# EAGLE design V-USB Volume Control T2313 V1.1 60mm x 60mm (EAGLE 6.5.0)
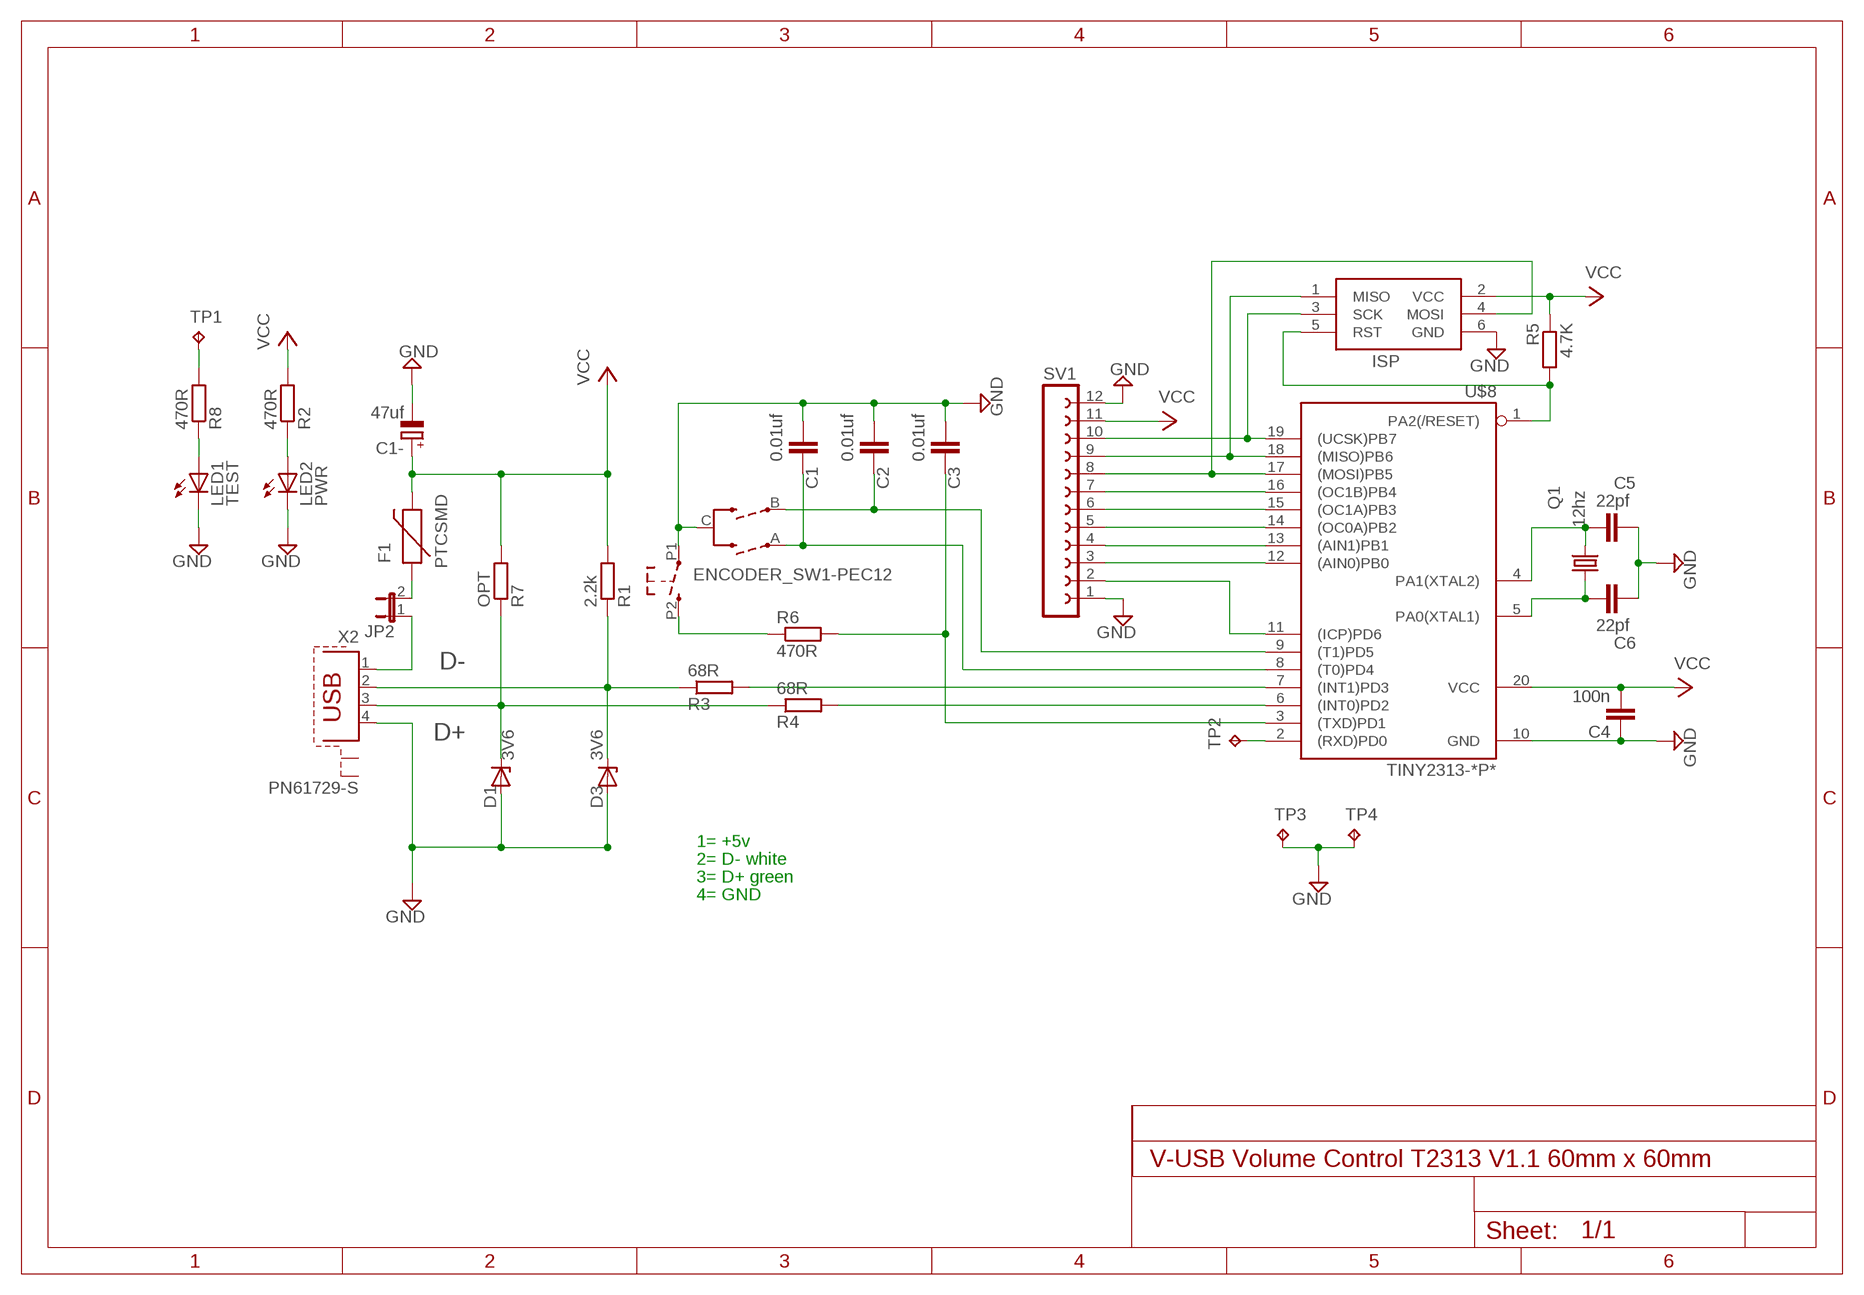
[diagram p0: schematic, sheet 1]

## Parts
C1  0.01uf  C5/2.5  [C5B2.5]
C1-  47uf  CPOL-EUE2.5-6  [E2,5-6]
C2  0.01uf  C5/2.5  [C5B2.5]
C3  0.01uf  C5/2.5  [C5B2.5]
C4  100n  C5/2.5  [C5B2.5]
C5  22pf  C2.5/2  [C2.5-2]
C6  22pf  C2.5/2  [C2.5-2]
D1  3V6  ZENER-DIODEDO34-7  [DO34Z7]
D3  3V6  ZENER-DIODEDO34-7  [DO34Z7]
F1  PTCSMD  [PTC-1206]
ISP  AVRISP-6  [AVRISP]
JP2  JP1E  [JP1]
LED1  TEST  LED3MM  [LED3MM]
LED2  PWR  LED3MM  [LED3MM]
Q1  12hz  CRYSTALHC49S  [HC49/S]
R1  2.2k  R-EU_0207/10  [0207/10]
R2  470R  R-EU_0204/7  [0204/7]
R3  68R  R-EU_0207/10  [0207/10]
R4  68R  R-EU_0207/10  [0207/10]
R5  4.7K  R-EU_0204/7  [0204/7]
R6  470R  R-EU_0204/7  [0204/7]
R7  OPT  R-EU_0207/10  [0207/10]
R8  470R  R-EU_0207/10  [0207/10]
SV1  FE12-1  [FE12]
SW3  ENCODER_SW1-PEC12  [PEC12_INCREMENTAL_ENCODER]
TP1  TPPAD1-13  [P1-13]
TP2  TPPAD1-13  [P1-13]
TP3  TPPAD1-20Y  [P1-20Y]
TP4  TPPAD1-20Y  [P1-20Y]
U$8  TINY2313-*P*  [DIL20]
X2  PN61729-S  [PN61729-S]

## Nets
D+: D1.C R4.1 R7.1 X2.3
D-: D3.C R1.1 R3.1 X2.2
ENC-A-P3: C1.2 SW3.A(ENCODER:A) U$8.8((T0)PD4)
ENC-B-P2: C2.2 SW3.B(ENCODER:B) U$8.9((T1)PD5)
GND: C1-.- C1.1 C2.1 C3.1 C4.1 C5.2 C6.2 D1.A D3.A ISP.6(GND) LED1.K(C) LED2.K(C) SV1.1 SV1.12 SW3.C(ENCODER:C) SW3.P1 TP3.TP TP4.TP U$8.10(GND) X2.4
MUTE: C3.2 R6.2 U$8.3((TXD)PD1)
N$1: ISP.4(MOSI) SV1.8 U$8.17((MOSI)PB5)
N$2: LED2.A R2.1
N$3: SV1.3 U$8.12((AIN0)PB0)
N$4: SV1.4 U$8.13((AIN1)PB1)
N$6: ISP.3(SCK) SV1.10 U$8.19((UCSK)PB7)
N$7: SV1.5 U$8.14((OC0A)PB2)
N$8: C6.1 Q1.1 U$8.5(PA0(XTAL1))
N$9: SV1.6 U$8.15((OC1A)PB3)
N$10: SV1.7 U$8.16((OC1B)PB4)
N$11: R6.1 SW3.P2
N$12: JP2.1 X2.1
N$13: C5.1 Q1.2 U$8.4(PA1(XTAL2))
N$14: ISP.5(RST) R5.2 U$8.1(PA2(/RESET))
N$15: R4.2 U$8.6((INT0)PD2)
N$16: ISP.1(MISO) SV1.9 U$8.18((MISO)PB6)
N$17: SV1.2 U$8.11((ICP)PD6)
N$18: R3.2 U$8.7((INT1)PD3)
N$19: TP2.TP U$8.2((RXD)PD0)
N$20: F1.1 JP2.2
N$21: LED1.A R8.1
N$22: R8.2 TP1.TP
VCC: C1-.+ C4.2 F1.2 ISP.2(VCC) R1.2 R2.2 R5.1 R7.2 SV1.11 U$8.20(VCC)
Unconnected: X2.S1 X2.S2

## Notes on the sheet
- 1= +5v
- 2= D- white
- 3= D+ green
- 4= GND

## Library data of the parts
C1-C6 = capacitor-wima:C: CAPACITOR naming: grid - package width
C1- = rcl:CPOL-EU: POLARIZED CAPACITOR, European symbol
D1 D3 = diode:ZENER-DIODE: Z-Diode
F1 = SparkFun:PTC: Resettable Fuse PTC Resettable Fuse. Spark Fun Electronics SKU : COM-08357
ISP = adafruit:AVRISP: AVR ISP HEADER Standard 6 pin header for AVR programming
JP2 = jumper:JP1E: JUMPER
LED1 LED2 = led:LED: LED OSRAM: - CHIPLED LG R971, LG N971, LY N971, LG Q971, LY Q971, LO R971, LY R971 LH N974, LH R974 LS Q976, LO Q976, LY Q976 LO Q996 - Hyper CHIPLED LW Q18S LB Q993, LB Q99A, LB R99A - SideLED LS A670, LO A670, LY A670, LG A670, LP A670 LB A673, LV A673, LT A673, LW A673 LH A674 LY A675 LS A676, LA A676, LO A676, LY A676, LW A676 LS A679, LY A679, LG A679 - Hyper Micro SIDELED® LS Y876, LA Y876, LO Y876, LY Y876 LT Y87S - SmartLED LW L88C, LW L88S LB L89C, LB L89S, LG L890 LS L89K, LO L89K, LY L89K LS L896, LA L896, LO L896, LY L896 - TOPLED LS T670, LO T670, LY T670, LG T670, LP T670 LSG T670, LSP T670, LSY T670, LOP T670, LYG T670 LG T671, LOG T671, LSG T671 LB T673, LV T673, LT T673, LW T673 LH T674 LS T676, LA T676, LO T676, LY T676, LB T676, LH T676, LSB T676, LW T676 LB T67C, LV T67C, LT T67C, LS T67K, LO T67K, LY T67K, LW E67C LS E67B, LA E67B, LO E67B, LY E67B, LB E67C, LV E67C, LT E67C LW T67C LS T679, LY T679, LG T679 LS T770, LO T770, LY T770, LG T770, LP T770 LB T773, LV T773, LT T773, LW T773 LH T774 LS E675, LA E675, LY E675, LS T675 LS T776, LA T776, LO T776, LY T776, LB T776 LHGB T686 LT T68C, LB T68C - Hyper Mini TOPLED® LB M676 - Mini TOPLED Santana® LG M470 LS M47K, LO M47K, LY M47K Source: http://www.osram.convergy.de LUXEON: - LUMILED® LXK2-PW12-R00, LXK2-PW12-S00, LXK2-PW14-U00, LXK2-PW14-V00 LXK2-PM12-R00, LXK2-PM12-S00, LXK2-PM14-U00 LXK2-PE12-Q00, LXK2-PE12-R00, LXK2-PE12-S00, LXK2-PE14-T00, LXK2-PE14-U00 LXK2-PB12-K00, LXK2-PB12-L00, LXK2-PB12-M00, LXK2-PB14-N00, LXK2-PB14-P00, LXK2-PB14-Q00 LXK2-PR12-L00, LXK2-PR12-M00, LXK2-PR14-Q00, LXK2-PR14-R00 LXK2-PD12-Q00, LXK2-PD12-R00, LXK2-PD12-S00 LXK2-PH12-R00, LXK2-PH12-S00 LXK2-PL12-P00, LXK2-PL12-Q00, LXK2-PL12-R00 Source: www.luxeon.com KINGBRIGHT: KA-3528ASYC Source: www.kingbright.com
Q1 = adafruit:CRYSTAL: CRYSTAL; OC_FARNELL: 1667008; OC_NEWARK: unknown
R1-R8 = resistor:R-EU_: RESISTOR, European symbol
SV1 = con-lsta:FE12-1: FEMALE HEADER; OC_FARNELL: unknown; OC_NEWARK: unknown
SW3 = dp_devices:ENCODER_SW1: Incremental Encoder with push switch
TP1-TP4 = testpad:TP: Test pad
U$8 = avr-7:TINY2313*: Atmel Tiny2313 2K Flash, 128 bytes EEPROM, 128 bytes RAM
X2 = con-berg:PN61729-S: BERG USB connector; OC_FARNELL: unknown; OC_NEWARK: unknown

## Board
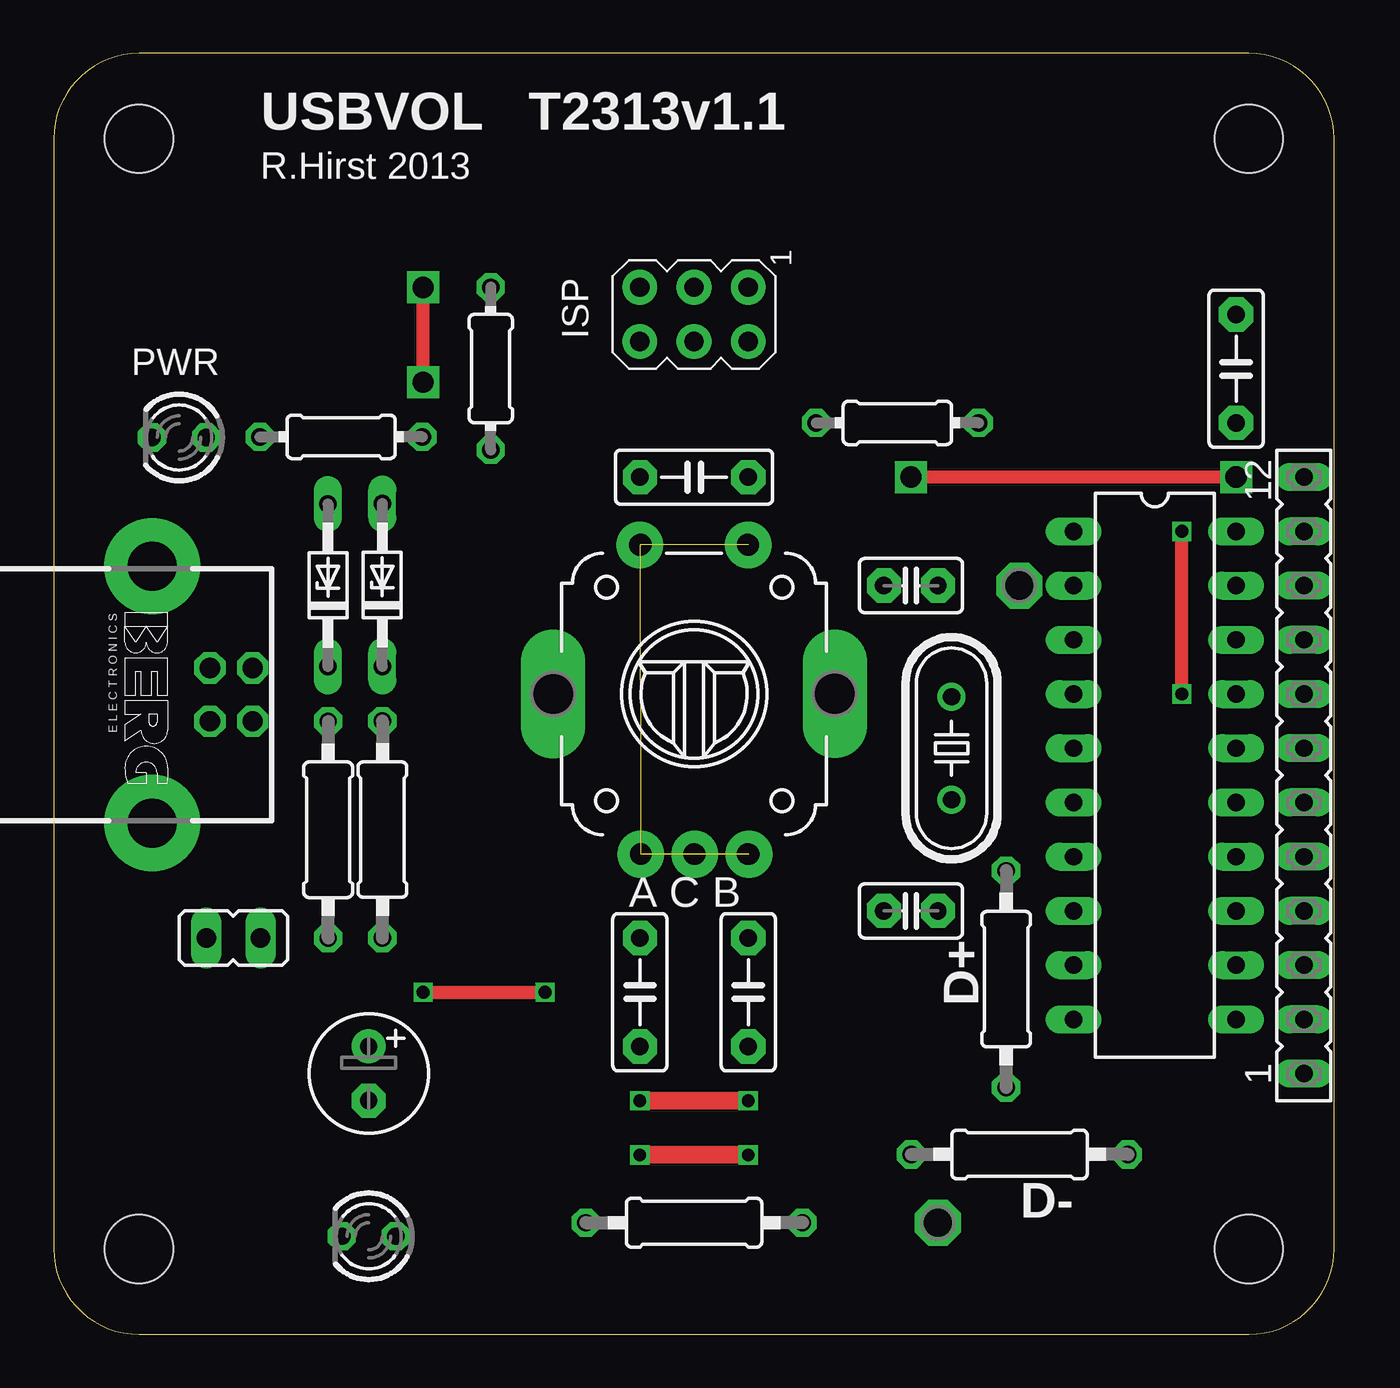
[diagram p1: board, top side]
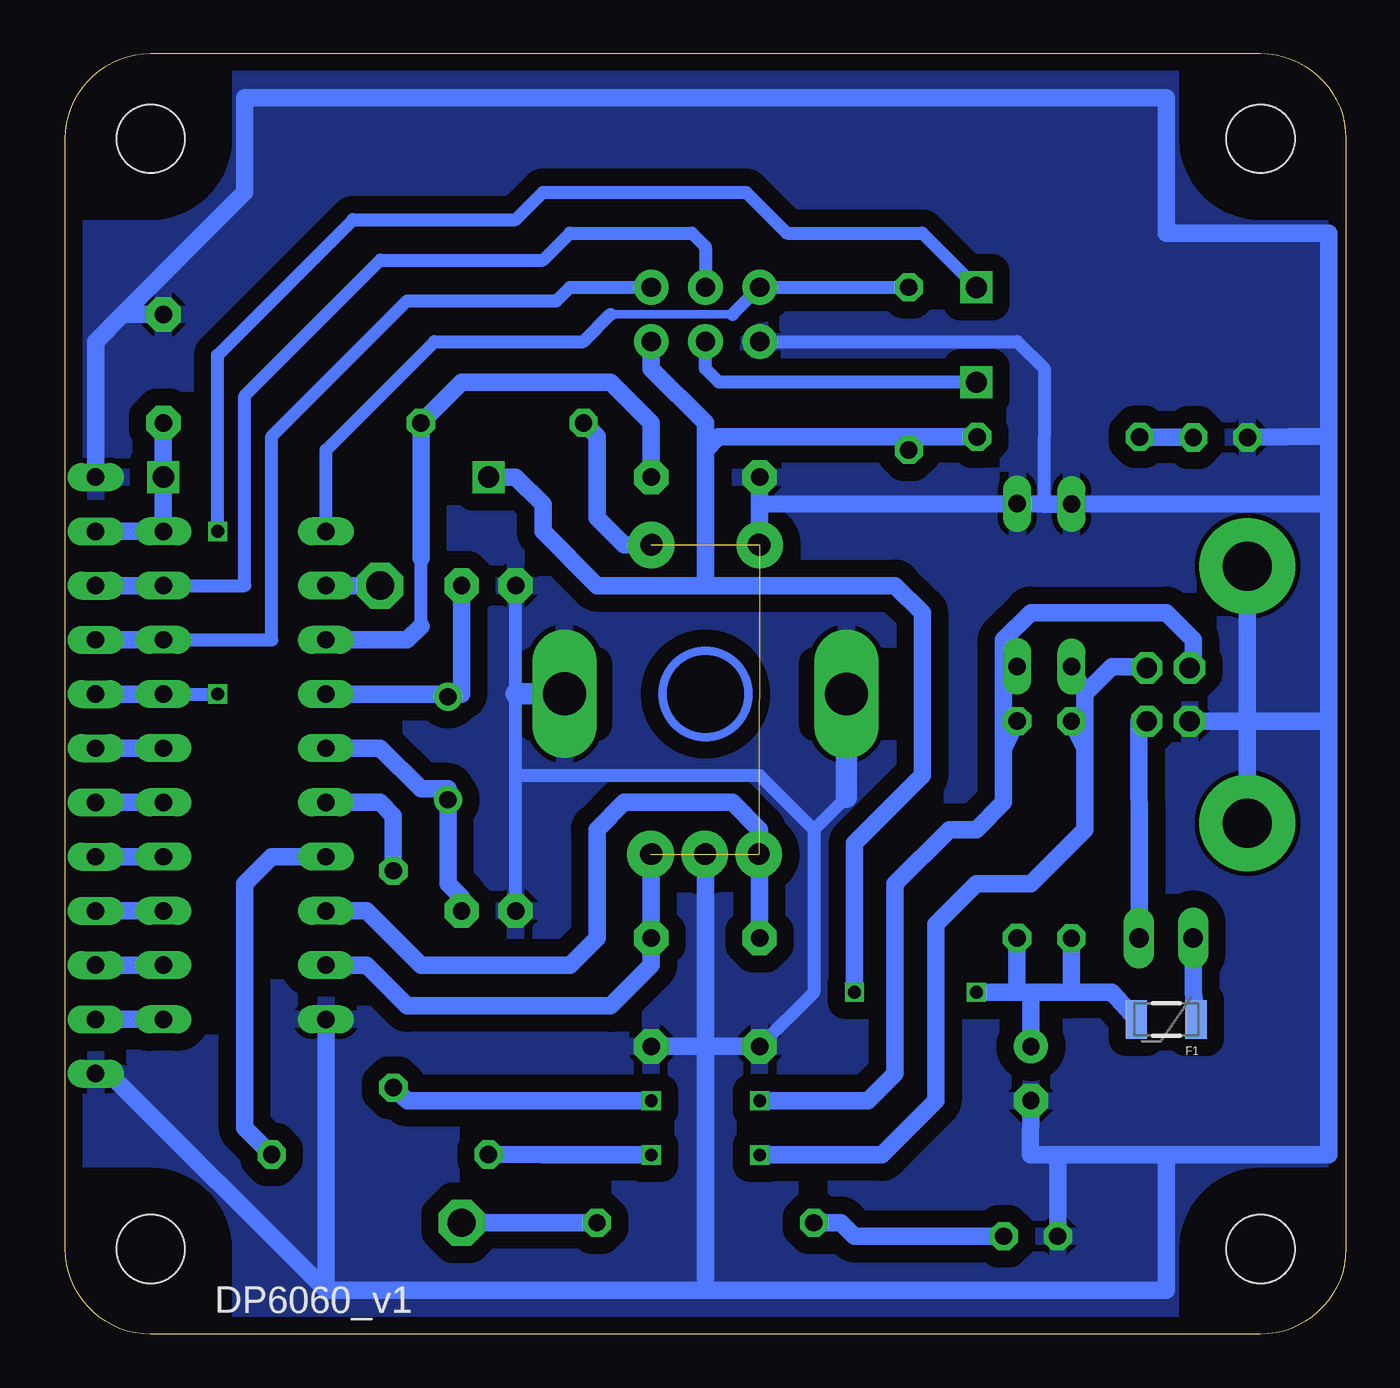
[diagram p2: board, bottom side, seen from below]

Size 60 x 60 mm. Coordinates in mm from the lower left corner, seen from the top.
Copper layers (1*16): Top 0.035mm / dielectric 1.5mm / Bottom 0.035mm
Design rules "Fusion_eagle_rule_v1.1 *": minimum track width 6mil, minimum drill 12mil, track to track 20mil, track to pad 20mil, pad to pad 20mil, via to via 20mil, smd to smd 8mil, copper to edge 4mil, drill to drill 4mil, minimum pad ring 10mil, minimum via ring 6mil, stop-mask expansion 2mil, vias tented up to drill 100mil, thermal gap 10mil

### Footprints (pad centres in the part's own frame; a part is rotated, then mirrored left to right if it is on the bottom)
C5B2.5 = drill 0.813 pad 1.6 octagon: 1 -2.54,0; 2 2.54,0
E2,5-6 = drill 0.813 pad 1.6: + -1.27,0 | drill 0.813 pad 1.6 octagon: - 1.27,0
C2.5-2 = drill 0.813 pad 1.6 octagon: 1 -1.27,0; 2 1.27,0
DO34Z7 = drill 0.813 long: A 3.81,0; C -3.81,0
PTC-1206 = smd 1 x 1.8: 1 -1.4,0; 2 1.4,0
AVRISP = drill 0.9 pad 1.626: 1 -1.27,2.54; 2 1.27,2.54; 3 -1.27,0; 4 1.27,0; 5 -1.27,-2.54; 6 1.27,-2.54
JP1 = drill 0.914 long: 1 0,-1.27; 2 0,1.27
LED3MM = drill 0.813 octagon: A -1.27,0; K 1.27,0
HC49/S = drill 0.813: 1 -2.413,0; 2 2.413,0
0207/10 = drill 0.813 octagon: 1 -5.08,0; 2 5.08,0
0204/7 = drill 0.813 octagon: 1 -3.81,0; 2 3.81,0
FE12 = drill 0.813 long: 1 -13.97,0; 2 -11.43,0; 3 -8.89,0; 4 -6.35,0; 5 -3.81,0; 6 -1.27,0; 7 1.27,0; 8 3.81,0; 9 6.35,0; 10 8.89,0; 11 11.43,0; 12 13.97,0
PEC12_INCREMENTAL_ENCODER = drill 1: A -2.5,-7.5; B 2.5,-7.5; C 0,-7.5; P1 -2.5,7; P2 2.5,7 | drill 1.9 square: GND@1 -6.6,0; GND@2 6.6,0
P1-13 = drill 1.321 pad 2.159 octagon: TP 0,0
P1-20Y = drill 2.007 pad 2.54 long: TP 0,0
DP6060_V1 = hole 3.2: 4,4; 56,4; 56,56; 4,56; 4,4; 56,4; 56,56; 4,56
DIL20 = drill 0.813 long: 1 -11.43,-3.81; 2 -8.89,-3.81; 3 -6.35,-3.81; 4 -3.81,-3.81; 5 -1.27,-3.81; 6 1.27,-3.81; 7 3.81,-3.81; 8 6.35,-3.81; 9 8.89,-3.81; 10 11.43,-3.81; 11 11.43,3.81; 12 8.89,3.81; 13 6.35,3.81; 14 3.81,3.81; 15 1.27,3.81; 16 -1.27,3.81; 17 -3.81,3.81; 18 -6.35,3.81; 19 -8.89,3.81; 20 -11.43,3.81
PN61729-S = drill 0.95 octagon: 1 1.25,4.71; 2 -1.25,4.71; 3 -1.25,2.71; 4 1.25,2.71 | drill 2.3 pad 2.9: S1 -6.02,0; S2 6.02,0

### Placement (x,y rotation side)
C1  27.47,16.02 90 top
C1-  14.76,12.22 270 top
C2  32.55,16.02 90 top
C3  30.01,40.15 0 top
C4  55.41,45.23 270 top
C5  40.17,35.07 180 top
C6  40.17,19.83 180 top
D1  15.4,35.1 90 top
D3  12.85,35.08 90 top
F1  8.41,14.75 180 bottom
ISP  30.01,47.77 270 top
JP2  8.42,18.56 90 top
LED1  14.77,4.59 180 top
LED2  5.88,42.01 180 top
Q1  42.07,27.45 90 top
R1  12.86,23.63 270 top
R2  13.47,42.04 0 top
R3  45.25,8.42 0 top
R4  44.63,16.63 90 top
R5  20.48,45.24 90 top
R6  39.53,42.69 0 top
R7  15.4,23.64 270 top
R8  30.01,5.23 0 top
SV1  58.58,26.18 90 top
SW3  30.01,29.99 0 top
TP1  41.44,5.23 0 top
TP2  45.25,35.07 0 top
TP3  36.6,30.01 0 top
TP4  23.4,29.99 0 top
U$2  [DP6060_V1]  0,0 0 top
U$8  51.6,26.18 270 top
X2  4.61,29.96 270 top

### Tracks (layer width: path | path; a pad name or v marks a point on that pad's centre or on a via)
D+  (via drill 0.6)
  Top 0.813: v27.47,10.94 v32.55,10.94
  Bottom 0.813: 16.03,27.45 R7.1 16.03,27.45 | 16.03,27.45 16.03,31.26 | 16.03,31.26 16.03,32.53 14.77,33.8 8.42,33.8 7.15,32.53 7.15,31.38 X2.3 | D1.C 16.01,31.29 16.03,31.26 | 16.03,27.45 16.04,27.45 16.04,24.91 17.31,23.64 18.58,23.64 21.12,21.1 21.12,12.21 22.39,10.94 v27.47,10.94 | v32.55,10.94 43.97,10.94 R4.1
D-  (via drill 0.6)
  Top 0.813: v27.47,8.4 v32.55,8.4
  Bottom 0.813: 12.23,27.45 12.23,23.64 14.77,21.1 17.31,21.1 19.21,19.2 19.21,10.94 21.74,8.41 26.19,8.41 v27.47,8.4 | 12.23,27.45 12.23,29.99 12.22,30 | 12.22,30 10.96,31.26 9.37,31.26 X2.2 | D3.C 12.22,30 | R1.1 12.23,27.44 12.23,27.45 | v32.55,8.4 37.61,8.4 R3.1
ENC-A-P3
  Bottom 0.813: C1.2 27.47,22.45 SW3.A 27.47,22.53 27.47,23.64 28.74,24.91 33.82,24.91 35.09,23.64 35.09,18.56 36.36,17.29 43.34,17.29 45.88,19.83 U$8.8
ENC-B-P2
  Bottom 0.813: SW3.B 32.55,22.45 C2.2 32.55,17.29 34.45,15.39 43.98,15.39 45.88,17.29 U$8.9
GND  (via drill 1.1 pad 4.5)
  Bottom 0.406: v4.61,35.98 4.61,28.72
  Bottom 0.61: 38.9,29.99 C6.2 38.9,26.18 27.47,26.18 24.93,23.64 | 38.9,29.99 C5.2 | 24.93,23.64 24.93,16.02 C1.1 | 23.4,25.16 24.93,23.64 | 38.88,30.01 38.9,29.99 | ISP.6 15.4,46.5 14.13,45.23 14.14,38.89
  Bottom 0.813: 0.8,42.06 0.8,38.88 | 0.8,38.88 0.8,28.72 | v4.61,35.98 v4.61,23.96 v4.61,23.95 | 0.8,28.72 4.61,28.72 7.15,28.71 X2.4 | 30.01,22.37 SW3.C 30.01,13.48 | 30.01,13.48 30.01,2.05 | 27.47,38.88 D1.A 14.14,38.89 13.5,38.88 D3.A 0.8,38.88 | 27.47,38.88 C3.1 | 27.47,38.88 SW3.P1 | LED2.K 0.8,42.06 | 0.8,28.72 0.8,8.4 8.42,8.4 | 30.01,2.05 8.42,2.05 8.42,8.4 | 8.42,8.4 8.44,8.4 | 30.01,2.05 47.79,2.05 | 47.79,2.05 U$8.10 | C1-.- 14.77,8.41 13.5,8.4 | 13.5,8.4 8.42,8.4 | 0.8,42.06 0.8,51.58 8.42,51.58 8.42,57.93 51.6,57.93 51.6,53.49 57.31,47.77 | C1.1 30.01,13.48 | C2.1 30.01,13.48 | SV1.1 57.95,12.21 47.79,2.05 | 57.31,47.77 58.58,46.5 SV1.12 | C4.1 57.31,47.77 | LED1.K 13.5,8.4
  Bottom 1.016: TP4.TP 23.4,25.16 | TP3.TP 38.88,30.01
  pour Bottom (isolate 0.813): 60.49,-0.49 -0.55,-0.51 -0.47,60.47 60.49,60.47
MUTE
  Bottom 0.61: 43.34,33.17 43.34,36.34
  Bottom 0.813: C3.2 32.55,42.69 34.45,44.6 41.44,44.6 R6.2 43.34,36.34 | U$8.3 43.98,32.53 43.34,33.17
N$1  (via drill 0.6, 1)
  Top 0.61: v17.31,44.6 v17.31,49.04 | v52.87,29.99 v52.87,37.61
  Bottom 0.61: U$8.17 v52.87,29.99 | v17.31,44.6 29.37,44.6 30.01,45.23 ISP.4 | v17.31,49.04 19.85,51.58 26.2,51.58 28.1,53.49 37.63,53.49 38.9,52.22 46.52,52.22 52.87,45.87 v52.87,37.61
  Bottom 0.813: U$8.17 SV1.8
N$2
  Bottom 0.61: 9.63,42.01 R2.1
  Bottom 0.813: LED2.A 9.63,42.01
N$3
  Bottom 0.813: U$8.12 SV1.3
N$4
  Bottom 0.813: U$8.13 SV1.4
N$6
  Bottom 0.61: U$8.19 51.6,35.07 51.6,43.96 45.25,50.31 37.63,50.31 36.36,51.58 30.64,51.58 30.01,50.95 ISP.3
  Bottom 0.813: SV1.10 U$8.19
N$7
  Bottom 0.813: U$8.14 SV1.5
N$8
  Bottom 0.813: C6.1 41.44,20.47 42.07,21.1 Q1.1 42.07,25.55 43.34,25.55 45.25,27.45 U$8.5
N$9
  Bottom 0.813: U$8.15 SV1.6
N$10
  Bottom 0.813: U$8.16 SV1.7
N$11
  Bottom 0.813: SW3.P2 33.82,36.98 35.09,38.25 35.09,42.06 R6.1
N$12
  Bottom 0.813: X2.1 9.69,28.72 9.68,21.22 9.68,19.83 JP2.1
N$13
  Bottom 0.813: 41.44,29.99 Q1.2 41.44,29.99 | C5.1 41.44,29.99 | U$8.4 41.44,29.99
N$14
  Bottom 0.406: 28.74,47.77 34.45,47.77
  Bottom 0.61: U$8.1 47.79,41.42 42.71,46.5 35.72,46.5 34.45,47.77 | R5.2 21.12,49.04 ISP.5 28.74,47.77
N$15
  Bottom 0.813: R4.2 44.63,24.29 45.25,24.91 U$8.6
N$16
  Bottom 0.61: U$8.18 50.33,32.53 50.33,42.06 43.98,48.41 36.99,48.41 36.36,49.04 ISP.1
  Bottom 0.813: U$8.18 SV1.9
N$17
  Bottom 0.813: U$8.11 SV1.2
N$18
  Bottom 0.813: R3.2 50.35,8.42 51.6,9.67 51.6,21.1 50.33,22.37 U$8.7
N$19
  Bottom 0.813: TP2.TP U$8.2
N$20
  Bottom 0.813: JP2.2 7.15,16.02 F1.1
N$21
  Bottom 0.813: R8.1 23.66,5.23 23.02,4.59 LED1.A
N$22
  Bottom 0.813: R8.2 TP1.TP
N$23  (via drill 1 pad 2.18)  (4 unrouted)
  other vias: 32.55,36.98 27.47,36.98 27.5,22.49 30.04,22.49 32.58,22.49
VCC  (via drill 0.6, 1)
  Top 0.61: v55.41,40.15 v40.17,40.15 | v17.31,16.02 v23.02,16.02
  Bottom 0.813: C4.2 v55.41,40.15 U$8.20 SV1.11 | 30.01,35.07 35.09,35.07 37.63,37.61 37.63,38.88 38.9,40.15 v40.17,40.15 | 30.01,35.07 21.12,35.07 19.85,33.8 19.85,26.18 23.02,23.01 v23.02,16.02 | 15.4,16.02 R7.2 | F1.2 10.96,16.02 12.86,16.02 | 12.86,16.02 14.77,16.02 | 14.77,16.02 15.4,16.02 | R1.2 12.86,16.02 | v17.31,16.02 15.4,16.02 | C1-.+ 14.77,16.02 | 30.01,41.42 30.01,42.69 32.55,45.23 ISP.2 | 30.01,41.42 30.01,35.07 | R2.2 20.48,42.04 | 20.48,42.04 29.39,42.04 30.01,41.42 | R5.1 20.48,42.03 20.48,42.04
(copper drawn outside any net)
  shapes: Bottom circle x1

### Text on the board
_tsilk: USBVOL T2313v1.1 | R.Hirst 2013 | A C B | D+ | D-